# EAGLE schematic SPEEDuino_v1_0 (EAGLE 7.6.0)
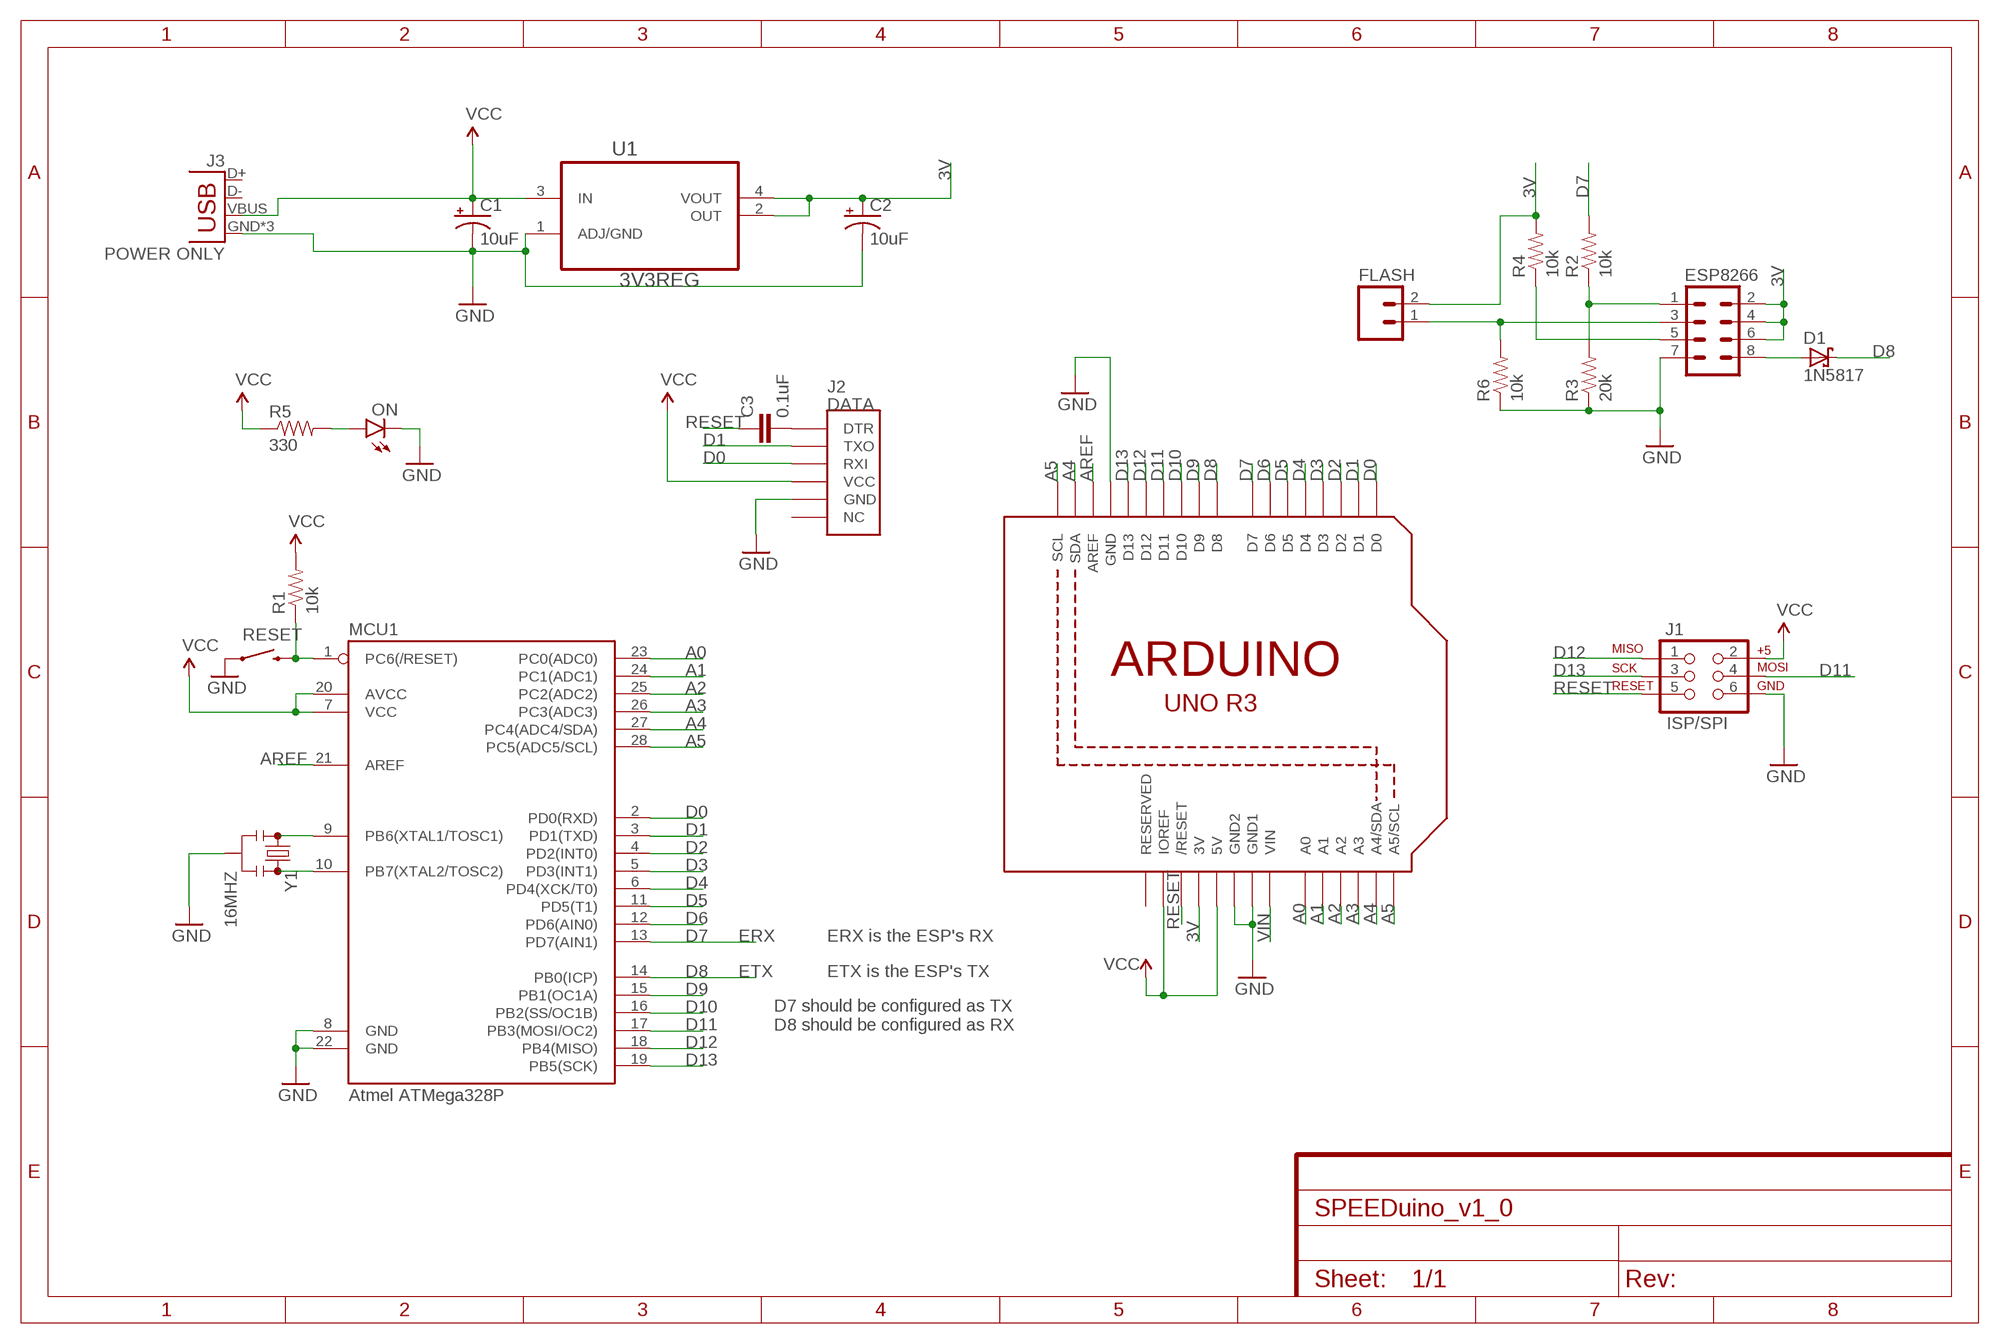
[diagram p0: schematic, sheet 1]
FRAME1 (FRAME-A4L): CNAME: SPEEDuino Mk I; CREVISION: 0.1a; DESIGNER: Pan Ziyue

## Parts
C1  10uF  CAP_POL1206-KIT  [EIA3216-KIT]
C2  10uF  CAP_POL1206-KIT  [EIA3216-KIT]
C3  0.1uF  CAP1206  [1206]
D1  1N5817  [DO41-10]
ESP8266  M04X2  [2X4]
FLASH  M02LOCK  [1X02_LOCK]
J1  ISP/SPI  AVR_SPI_PRG_6PTH  [2X3]
J2  DATA  CP2102_DEVICECP  [CP2102_DEVICE_SIDE]
J3  POWER ONLY  USB-MICROB  [USB-MICROB]
MCU1  Atmel ATMega328P  ATMEGA328P_PDIP  [DIL28-3]
ON  LED3MM  [LED3MM]
R1  10k  RESISTOR1206  [1206]
R2  10k  RESISTOR1206  [1206]
R3  20k  RESISTOR1206  [1206]
R4  10k  RESISTOR1206  [1206]
R5  330  RESISTOR1206  [1206]
R6  10k  RESISTOR1206  [1206]
RESET  SWITCH-MOMENTARY-2PTH  [TACTILE-PTH]
U1  3V3REG  LM1117MP-3.3  [SOT230P696X180-4N]
U2  ARDUINOR3-DIMENSION  [ARDUINOR3]
Y1  16MHZ  RESONATOR16MHZ  [RESONATOR-SMD]

## Nets
3V: C2.A(+) ESP8266.2 ESP8266.4 ESP8266.6 FLASH.2 R4.2 U1.2(OUT) U1.4(VOUT) U2.3V
A0: MCU1.23(PC0(ADC0)) U2.A0
A1: MCU1.24(PC1(ADC1)) U2.A1
A2: MCU1.25(PC2(ADC2)) U2.A2
A3: MCU1.26(PC3(ADC3)) U2.A3
A4: MCU1.27(PC4(ADC4/SDA)) U2.A4(A4/SDA) U2.SDA
A5: MCU1.28(PC5(ADC5/SCL)) U2.A5(A5/SCL) U2.SCL
AREF: MCU1.21(AREF) U2.AREF
D0: J2.P$3(RXI) MCU1.2(PD0(RXD)) U2.D0
D1: J2.P$2(TXO) MCU1.3(PD1(TXD)) U2.D1
D2: MCU1.4(PD2(INT0)) U2.D2
D3: MCU1.5(PD3(INT1)) U2.D3
D4: MCU1.6(PD4(XCK/T0)) U2.D4
D5: MCU1.11(PD5(T1)) U2.D5
D6: MCU1.12(PD6(AIN0)) U2.D6
D7: MCU1.13(PD7(AIN1)) R2.2 U2.D7
D8: D1.C MCU1.14(PB0(ICP)) U2.D8
D9: MCU1.15(PB1(OC1A)) U2.D9
D10: MCU1.16(PB2(SS/OC1B)) U2.D10
D11: J1.4 MCU1.17(PB3(MOSI/OC2)) U2.D11
D12: J1.1 MCU1.18(PB4(MISO)) U2.D12
D13: J1.3 MCU1.19(PB5(SCK)) U2.D13
GND: C1.C(-) C2.C(-) ESP8266.7 J1.6 J2.P$5(GND) J3.GND J3.MT1(GND) J3.MT2(GND) MCU1.8(GND) MCU1.22(GND) ON.K(C) R3.1 R6.1 RESET.1 U1.1(ADJ/GND) U2.GND U2.GND1 U2.GND2 Y1.2
N$1: MCU1.10(PB7(XTAL2/TOSC2)) Y1.3
N$2: ESP8266.1 R2.1 R3.2
N$3: ESP8266.5 R4.1
N$4: ON.A R5.2
N$5: MCU1.9(PB6(XTAL1/TOSC1)) Y1.1
N$6: C3.2 J2.P$1(DTR)
N$7: D1.A ESP8266.8
N$8: ESP8266.3 FLASH.1 R6.2
RESET: C3.1 J1.5 MCU1.1(PC6(/RESET)) R1.1 RESET.3 U2.RESET(/RESET)
VCC: C1.A(+) J1.2 J2.P$4(VCC) J3.VBUS MCU1.7(VCC) MCU1.20(AVCC) R1.2 R5.1 U1.3(IN) U2.5V U2.IOREF
VIN: U2.VIN
Unconnected: J2.P$6(NC) J3.D+ J3.D- U2.RESERVED

## Notes on the sheet
- ERX | ERX is the ESP's RX
- ETX | ETX is the ESP's TX
- D7 should be configured as TX
  D8 should be configured as RX

## Library data of the parts
C1 C2 = SparkFun-Capacitors:CAP_POL: Capacitor Polarized These are standard SMD and PTH capacitors. Normally 10uF, 47uF, and 100uF in electrolytic and tantalum varieties. Always verify the external diameter of the through hole cap, it varies with capacity, voltage, and manufacturer. The EIA devices should be standard.
C3 = SparkFun-Capacitors:CAP: Capacitor Standard 0603 ceramic capacitor, and 0.1" leaded capacitor.
D1 = diode:1N5817
ESP8266 = SparkFun-Connectors:M04X2: .1" header, two rows of four.
FLASH = SparkFun-Connectors:M02: Standard 2-pin 0.1" header. Use with - straight break away headers ( PRT-00116) - right angle break away headers (PRT-00553) - swiss pins (PRT-00743) - machine pins (PRT-00117) - female headers (PRT-00115) Molex polarized connector foot print use with: PRT-08233 with associated crimp pins and housings. 2.54_SCREWTERM for use with PRT-10571. 3.5mm Screw Terminal footprints for PRT-08084 5mm Screw Terminal footprints for use with PRT-08432
J1 = SparkFun-Connectors:AVR_SPI_PRG_6: AVR ISP 6 Pin This is the reduced ISP connector for AVR programming. Common on Arduino. This footprint will take up less PCB space and can be used with a 10-pin to 6-pin adapter such as SKU: BOB-08508 **Special note about "TEST_POINT" package. The stop mask is on the top side, so if you want your programming test points to be on the bottom of your board, make sure to place this package on the bottom side of the board. This also ensure that the orientation to program from the bottom side will be correct.
J2 = SparkFun-Connectors:CP2102_DEVICE: Connector which mates to CP2102 basic or CP2102 cable.
J3 = SparkFun-Connectors:USB: USB Connectors USB-B-PTH is fully proven SKU : PRT-00139/CONN-08278 USB-miniB is fully proven SKU : PRT-00587 USB-A-PCB is untested. USB-A-H is throughly reviewed, but untested. Spark Fun Electronics SKU : PRT-00437 USB-B-SMT is throughly reviewed, but untested. Needs silkscreen touching up. USB-A-S has not been used/tested USB-MB-H has not been used/tested USB-MICROB has been used. CONN-09505; PROD_ID: CONN-09505
MCU1 = SparkFun-DigitalIC:ATMEGA328P_PDIP: uC used in the Arduino 32kb flash, 1k EEPROM, 2k SRAM This is the through-hole version of this chip.
ON = SparkFun-LED:LED: LEDs Standard schematic elements and footprints for 5mm, 3mm, 1206, and 0603 sized LEDs. 5mm - Spark Fun Electronics SKU : COM-00529 (and others); PROD_ID: DIO-08794
R1-R6 = SparkFun-Resistors:RESISTOR: Resistor Basic schematic elements and footprints for 0603, 1206, and PTH resistors.
RESET = SparkFun-Electromechanical:SWITCH-MOMENTARY-2: Various NO switches- pushbuttons, reed, etc; PROD_ID: SWCH-08441
U1 = custom:LM1117MP-3.3: Linear regulators; MPN: LM1117MP-3.3; OC_FARNELL: 9778195; OC_NEWARK: 41K3470; PACKAGE: SOT223-3; SUPPLIER: NationalSemiconductor
U2 = adafruit:ARDUINOR3: This is a new object for the new Arduino R3 - with extra pins that you may want to use (such as IOref, and duplicated A4/A5
Y1 = SparkFun-FreqCtrl:RESONATOR: Resonator Small SMD resonator. Used, eg, on the Arduino Pro/ Pro Mini boards. 8MHz- XTAL-08895 16MHz- XTAL-08900; PROD_ID: XTAL-08900